# Altium project PCB_Project1.PrjPCB
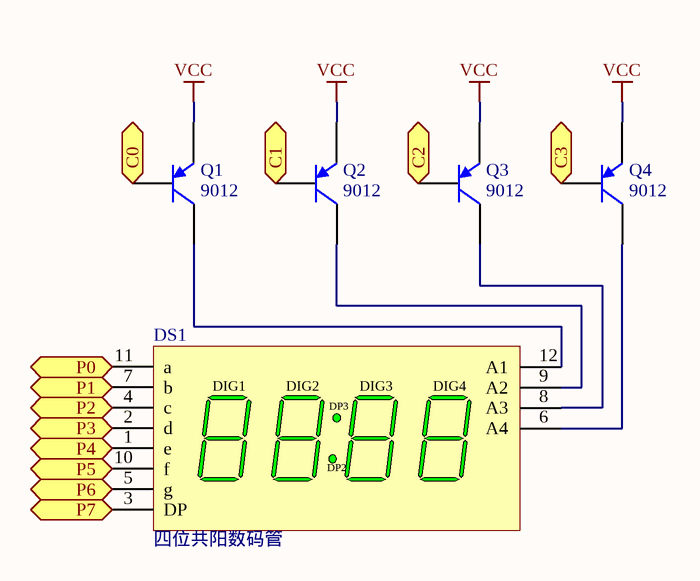
[diagram p0: Sheet1.SchDoc]
1 sheet, 5 parts. Net scope: flat (ports and power ports of the same name join across sheets).

## Sheet Sheet1.SchDoc
size A4

### Parts
DS1  四位共阳数码管  [B-88]
Q1  9012  [TO-92A]
Q2  9012  [TO-92A]
Q3  9012  [TO-92A]
Q4  9012  [TO-92A]

### Ports
C0, C1, C2, C3, P0, P1, P2, P3, P4, P5, P6, P7

### Nets
VCC: Q1.1(E) Q2.1(E) Q3.1(E) Q4.1(E)
NetDS1_1: DS1.1(e) ; port P4
NetDS1_2: DS1.2(d) ; port P3
NetDS1_3: DS1.3(DP) ; port P7
NetDS1_4: DS1.4(c) ; port P2
NetDS1_5: DS1.5(g) ; port P6
NetDS1_6: DS1.6(A4) Q4.3(C)
NetDS1_7: DS1.7(b) ; port P1
NetDS1_8: DS1.8(A3) Q3.3(C)
NetDS1_9: DS1.9(A2) Q2.3(C)
NetDS1_10: DS1.10(f) ; port P5
NetDS1_11: DS1.11(a) ; port P0
NetDS1_12: DS1.12(A1) Q1.3(C)
NetQ1_2: Q1.2(B) ; port C0
NetQ2_2: Q2.2(B) ; port C1
NetQ3_2: Q3.2(B) ; port C2
NetQ4_2: Q4.2(B) ; port C3

### Notes on the sheet
- (in symbol HDSP-B08G) DIG1; DIG2; DIG3; DIG4; DP3; DP2

### Library data of the parts
DS1 = HDSP-B08G: 14.22 mm Untinted, 88:88 4-Digit 7-Segment Display: CA, Gray Surface; LuminousIntensity: 3200 ucd (Minimum).; LED_Colour: Green; Published: 26-May-2004; LatestRevisionDate: 11-Oct-2004; LatestRevisionNote: Display outline superimposed on PCB Footprint.; DatasheetVersion: 23-Sep-2002; PackageVersion: 21-Aug-2001; PackageReference: B-88; Publisher: Altium Limited; PackageDescription: LED, 7-Segment Display, 14.22 mm, Four Digit, 88:88; 12 Leads; Row Space 15.24 mm; Pitch 2.54 mm; ComponentLink1Description: Manufacturer Link; ComponentLink1URL: http://www.agilent.com/; ComponentLink2Description: Datasheet; ComponentLink2URL: http://cp.literature.agilent.com/litweb/pdf/5988-7859EN.pdf
Q1-Q4 = 2N3906: PNP General Purpose Amplifier; Published: 8-Jun-2000; LatestRevisionDate: 15-Jan-2003; LatestRevisionNote: PCB Footprint 'BCY-W3/D4.7' replaced; DatasheetVersion: 1997; PackageVersion: Sep-1998; PackageReference: TO-92A; Publisher: Altium Limited; PackageDescription: TO, Flat Index; 3 In-Line, Axial Leads; Body Dia. 4.5mm; Leads 0.51 x 0.48 mm (max); ComponentLink1Description: Manufacturer Link; ComponentLink1URL: http://www.fairchildsemi.com/; ComponentLink2Description: Datasheet; ComponentLink2URL: http://www.fairchildsemi.com/ds/2N%2F2N3906.pdf